# Altium schematic sheet MR26_GSS_8.SchDoc
size 383 x 296 mm; Origin: Eagle; OriginPath: C:\Users\David Nguyen\Downloads\eagle\eagle\MR26_GSS.sch; OriginSheet: 9; OriginDescription: 10 FPGA unused banks, GND & NC
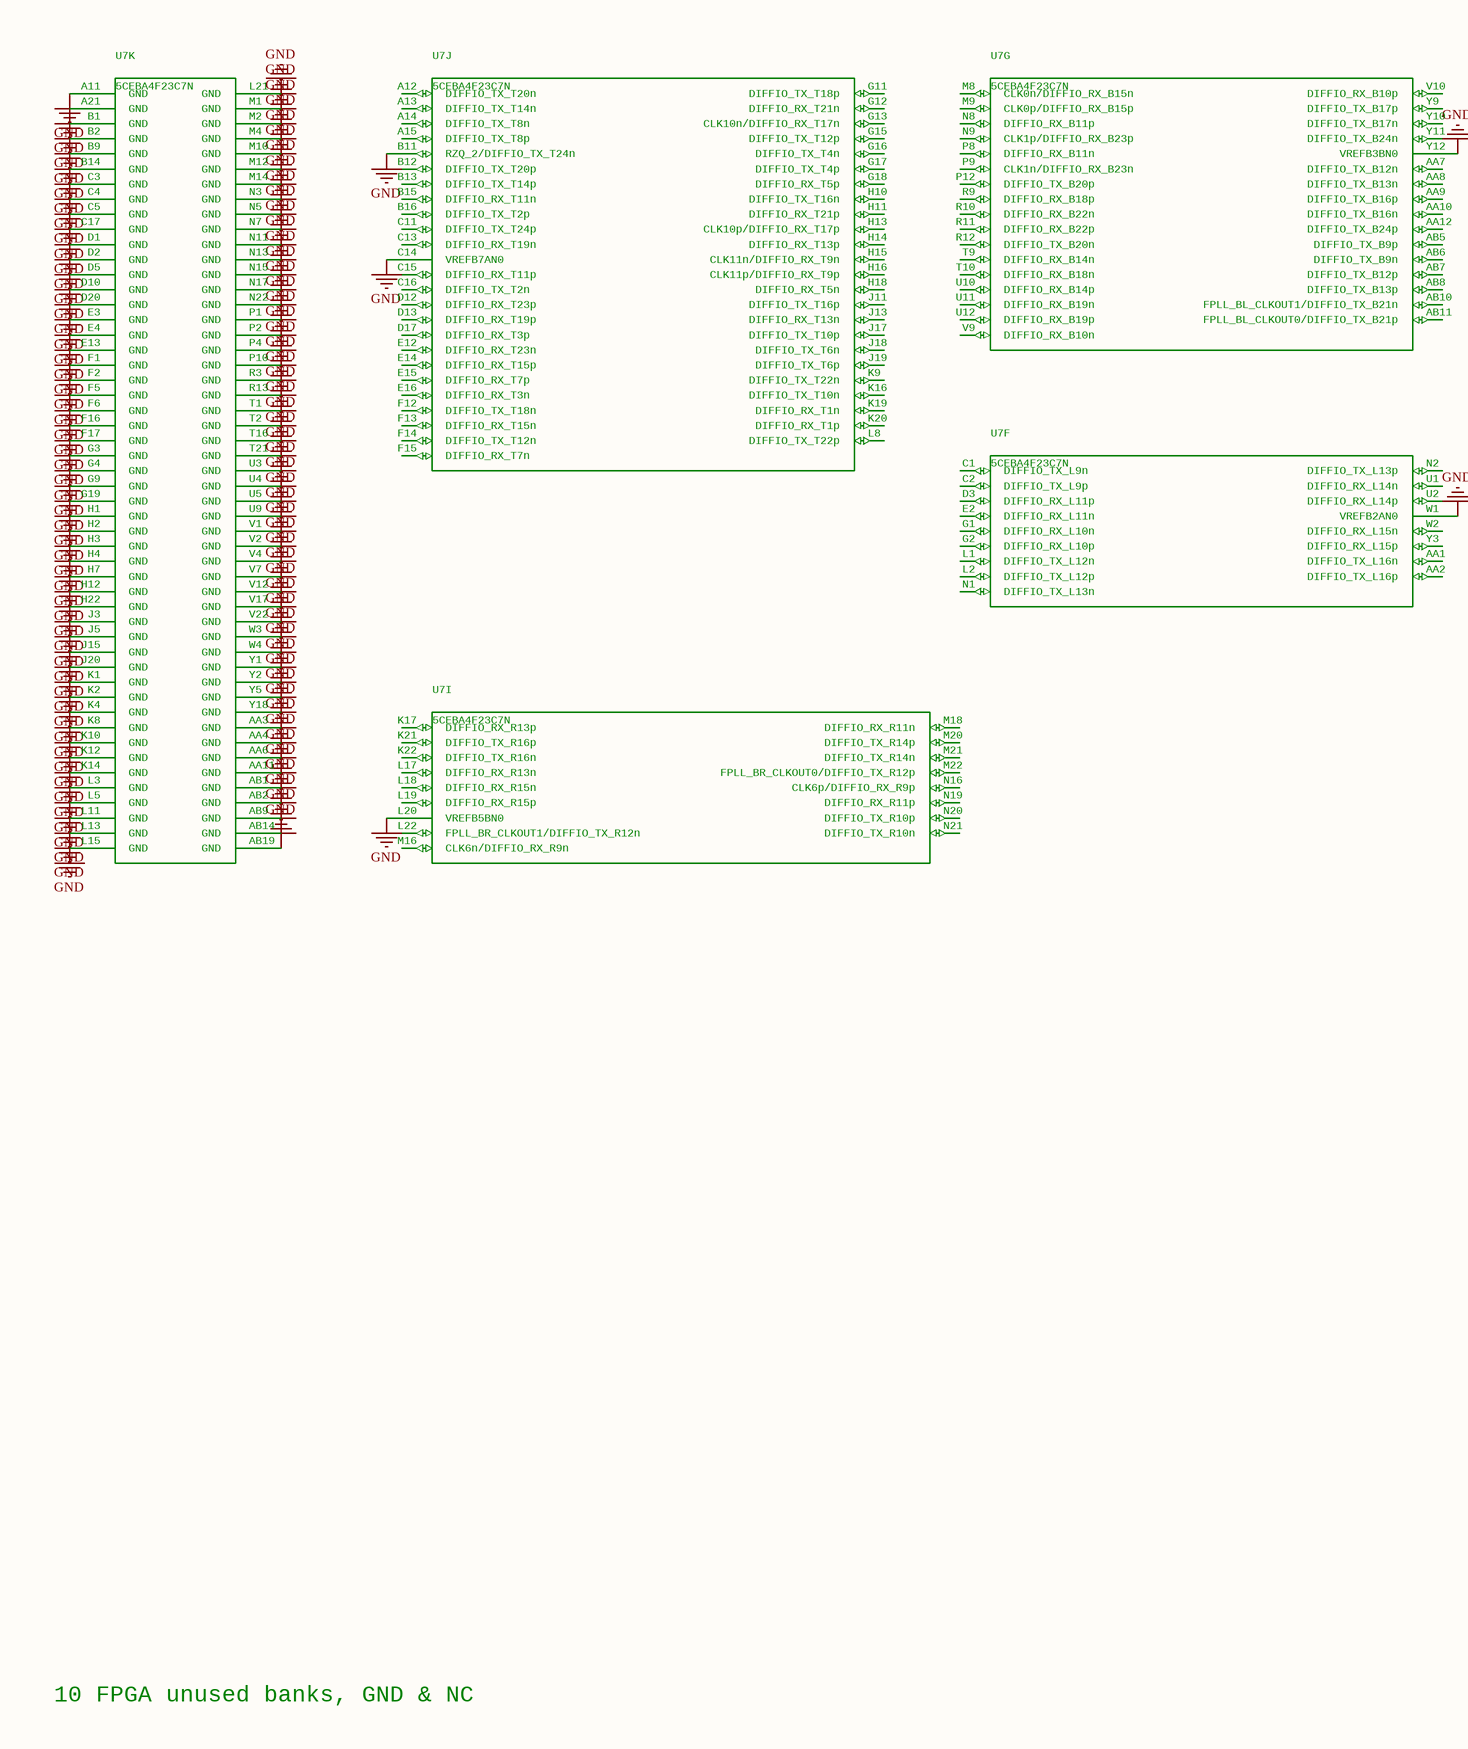
[diagram p0: MR26_GSS_8.SchDoc, left]
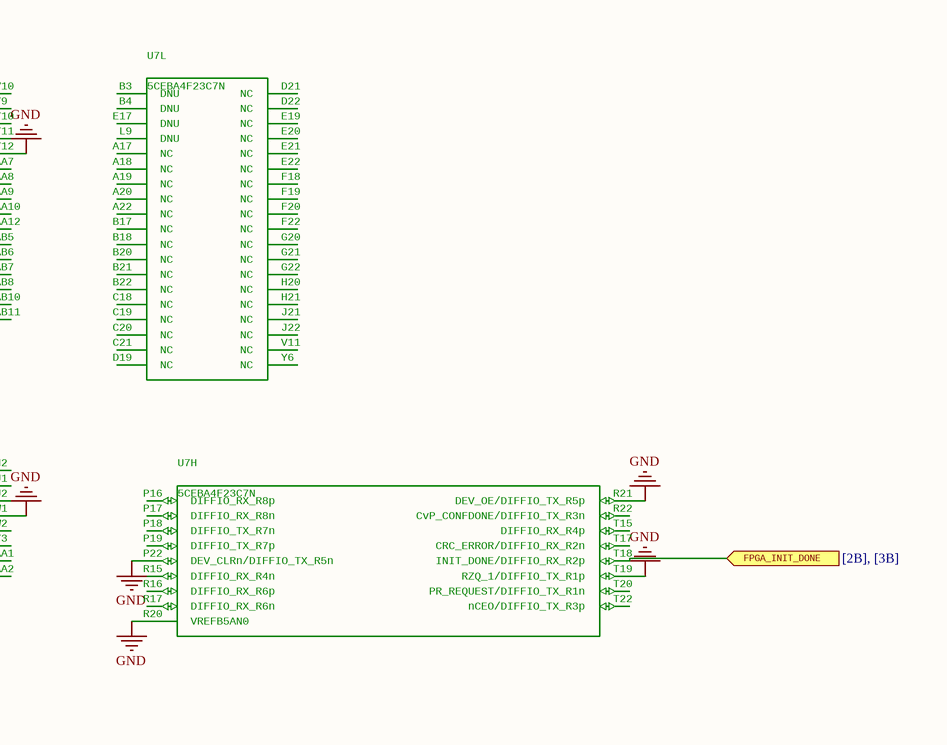
[diagram p1: MR26_GSS_8.SchDoc, right]

## Parts
U7  5CEBA4F23C7N  [FBGA-484_23x23_1.0mm]  (parts F,G,H,I,J,K,L of 12)

## Ports
FPGA_INIT_DONE (in, see [2B], [3B])

## Nets
GND: U7.A11(GND) U7.A21(GND) U7.AA3(GND) U7.AA4(GND) U7.AA6(GND) U7.AA11(GND) U7.AB1(GND) U7.AB2(GND) U7.AB9(GND) U7.AB14(GND) U7.AB19(GND) U7.B1(GND) U7.B2(GND) U7.B9(GND) U7.B11(RZQ_2/DIFFIO_TX_T24n) U7.B14(GND) U7.C3(GND) U7.C4(GND) U7.C5(GND) U7.C14(VREFB7AN0) U7.C17(GND) U7.D1(GND) U7.D2(GND) U7.D5(GND) U7.D10(GND) U7.D20(GND) U7.E3(GND) U7.E4(GND) U7.E13(GND) U7.F1(GND) U7.F2(GND) U7.F5(GND) U7.F6(GND) U7.F16(GND) U7.F17(GND) U7.G3(GND) U7.G4(GND) U7.G9(GND) U7.G19(GND) U7.H1(GND) U7.H2(GND) U7.H3(GND) U7.H4(GND) U7.H7(GND) U7.H12(GND) U7.H22(GND) U7.J3(GND) U7.J5(GND) U7.J15(GND) U7.J20(GND) U7.K1(GND) U7.K2(GND) U7.K4(GND) U7.K8(GND) U7.K10(GND) U7.K12(GND) U7.K14(GND) U7.L3(GND) U7.L5(GND) U7.L11(GND) U7.L13(GND) U7.L15(GND) U7.L20(VREFB5BN0) U7.L21(GND) U7.M1(GND) U7.M2(GND) U7.M4(GND) U7.M10(GND) U7.M12(GND) U7.M14(GND) U7.N3(GND) U7.N5(GND) U7.N7(GND) U7.N11(GND) U7.N13(GND) U7.N15(GND) U7.N17(GND) U7.N22(GND) U7.P1(GND) U7.P2(GND) U7.P4(GND) U7.P10(GND) U7.P22(DEV_CLRn/DIFFIO_TX_R5n) U7.R3(GND) U7.R13(GND) U7.R20(VREFB5AN0) U7.R21(DEV_OE/DIFFIO_TX_R5p) U7.T1(GND) U7.T2(GND) U7.T16(GND) U7.T19(RZQ_1/DIFFIO_TX_R1p) U7.T21(GND) U7.U3(GND) U7.U4(GND) U7.U5(GND) U7.U9(GND) U7.V1(GND) U7.V2(GND) U7.V4(GND) U7.V7(GND) U7.V12(GND) U7.V17(GND) U7.V22(GND) U7.W1(VREFB2AN0) U7.W3(GND) U7.W4(GND) U7.Y1(GND) U7.Y2(GND) U7.Y5(GND) U7.Y12(VREFB3BN0) U7.Y18(GND)
FPGA_INIT_DONE: U7.T18(INIT_DONE/DIFFIO_RX_R2p) ; port FPGA_INIT_DONE

Not connected (* = marked no-connect by the designer): U7 A12(DIFFIO_TX_T20n) A13(DIFFIO_TX_T14n) A14(DIFFIO_TX_T8n) A15(DIFFIO_TX_T8p) A17(NC) A18(NC) A19(NC) A20(NC) A22(NC) AA1(DIFFIO_TX_L16n) AA2(DIFFIO_TX_L16p) AA7(DIFFIO_TX_B12n) AA8(DIFFIO_TX_B13n) AA9(DIFFIO_TX_B16p) AA10(DIFFIO_TX_B16n) AA12(DIFFIO_TX_B24p) AB5(DIFFIO_TX_B9p) AB6(DIFFIO_TX_B9n) AB7(DIFFIO_TX_B12p) AB8(DIFFIO_TX_B13p) AB10(FPLL_BL_CLKOUT1/DIFFIO_TX_B21n) AB11(FPLL_BL_CLKOUT0/DIFFIO_TX_B21p) B3(DNU) B4(DNU) B12(DIFFIO_TX_T20p) B13(DIFFIO_TX_T14p) B15(DIFFIO_RX_T11n) B16(DIFFIO_TX_T2p) B17(NC) B18(NC) B20(NC) B21(NC) B22(NC) C1(DIFFIO_TX_L9n) C2(DIFFIO_TX_L9p) C11(DIFFIO_TX_T24p) C13(DIFFIO_RX_T19n) C15(DIFFIO_RX_T11p) C16(DIFFIO_TX_T2n) C18(NC) C19(NC) C20(NC) C21(NC) D3(DIFFIO_RX_L11p) D12(DIFFIO_RX_T23p) D13(DIFFIO_RX_T19p) D17(DIFFIO_RX_T3p) D19(NC) D21(NC) D22(NC) E2(DIFFIO_RX_L11n) E12(DIFFIO_RX_T23n) E14(DIFFIO_RX_T15p) E15(DIFFIO_RX_T7p) E16(DIFFIO_RX_T3n) E17(DNU) E19(NC) E20(NC) E21(NC) E22(NC) F12(DIFFIO_TX_T18n) F13(DIFFIO_RX_T15n) F14(DIFFIO_TX_T12n) F15(DIFFIO_RX_T7n) F18(NC) F19(NC) F20(NC) F22(NC) G1(DIFFIO_RX_L10n) G2(DIFFIO_RX_L10p) G11(DIFFIO_TX_T18p) G12(DIFFIO_RX_T21n) G13(CLK10n/DIFFIO_RX_T17n) G15(DIFFIO_TX_T12p) G16(DIFFIO_TX_T4n) G17(DIFFIO_TX_T4p) G18(DIFFIO_RX_T5p) G20(NC) G21(NC) G22(NC) H10(DIFFIO_TX_T16n) H11(DIFFIO_RX_T21p) H13(CLK10p/DIFFIO_RX_T17p) H14(DIFFIO_RX_T13p) H15(CLK11n/DIFFIO_RX_T9n) H16(CLK11p/DIFFIO_RX_T9p) H18(DIFFIO_RX_T5n) H20(NC) H21(NC) J11(DIFFIO_TX_T16p) J13(DIFFIO_RX_T13n) J17(DIFFIO_TX_T10p) J18(DIFFIO_TX_T6n) J19(DIFFIO_TX_T6p) J21(NC) J22(NC) K9(DIFFIO_TX_T22n) K16(DIFFIO_TX_T10n) K17(DIFFIO_RX_R13p) K19(DIFFIO_RX_T1n) K20(DIFFIO_RX_T1p) K21(DIFFIO_TX_R16p) K22(DIFFIO_TX_R16n) L1(DIFFIO_TX_L12n) L2(DIFFIO_TX_L12p) L8(DIFFIO_TX_T22p) L9(DNU) L17(DIFFIO_RX_R13n) L18(DIFFIO_RX_R15n) L19(DIFFIO_RX_R15p) L22(FPLL_BR_CLKOUT1/DIFFIO_TX_R12n) M8(CLK0n/DIFFIO_RX_B15n) M9(CLK0p/DIFFIO_RX_B15p) M16(CLK6n/DIFFIO_RX_R9n) M18(DIFFIO_RX_R11n) M20(DIFFIO_TX_R14p) M21(DIFFIO_TX_R14n) M22(FPLL_BR_CLKOUT0/DIFFIO_TX_R12p) N1(DIFFIO_TX_L13n) N2(DIFFIO_TX_L13p) N8(DIFFIO_RX_B11p) N9(CLK1p/DIFFIO_RX_B23p) N16(CLK6p/DIFFIO_RX_R9p) N19(DIFFIO_RX_R11p) N20(DIFFIO_TX_R10p) N21(DIFFIO_TX_R10n) P8(DIFFIO_RX_B11n) P9(CLK1n/DIFFIO_RX_B23n) P12(DIFFIO_TX_B20p) P16(DIFFIO_RX_R8p) P17(DIFFIO_RX_R8n) P18(DIFFIO_TX_R7n) P19(DIFFIO_TX_R7p) R9(DIFFIO_RX_B18p) R10(DIFFIO_RX_B22n) R11(DIFFIO_RX_B22p) R12(DIFFIO_TX_B20n) R15(DIFFIO_RX_R4n) R16(DIFFIO_RX_R6p) R17(DIFFIO_RX_R6n) R22(CvP_CONFDONE/DIFFIO_TX_R3n) T9(DIFFIO_RX_B14n) T10(DIFFIO_RX_B18n) T15(DIFFIO_RX_R4p) T17(CRC_ERROR/DIFFIO_RX_R2n) T20(PR_REQUEST/DIFFIO_TX_R1n) T22(nCEO/DIFFIO_TX_R3p) U1(DIFFIO_RX_L14n) U2(DIFFIO_RX_L14p) U10(DIFFIO_RX_B14p) U11(DIFFIO_RX_B19n) U12(DIFFIO_RX_B19p) V9(DIFFIO_RX_B10n) V10(DIFFIO_RX_B10p) V11(NC) W2(DIFFIO_RX_L15n) Y3(DIFFIO_RX_L15p) Y6(NC) Y9(DIFFIO_TX_B17p) Y10(DIFFIO_TX_B17n) Y11(DIFFIO_TX_B24n)

## Notes on the sheet
- 10 FPGA unused banks, GND & NC

## Library data of the parts
U7 = 5CEBA4F23C7NFBGA-484_23x23_1.0mm: GateName_1: A; SymbolName_1: 5CEBA4F23C7N_A; GateName_2: B; SymbolName_2: 5CEBA4F23C7N_B; GateName_3: C; SymbolName_3: 5CEBA4F23C7N_C; GateName_4: D; SymbolName_4: 5CEBA4F23C7N_D; GateName_5: E; SymbolName_5: 5CEBA4F23C7N_E; GateName_6: F; SymbolName_6: 5CEBA4F23C7N_F; GateName_7: G; SymbolName_7: 5CEBA4F23C7N_G; GateName_8: H; SymbolName_8: 5CEBA4F23C7N_H; GateName_9: I; SymbolName_9: 5CEBA4F23C7N_I; GateName_10: J; SymbolName_10: 5CEBA4F23C7N_J; GateName_11: K; SymbolName_11: 5CEBA4F23C7N_K; GateName_12: L; SymbolName_12: 5CEBA4F23C7N_L; DeviceName: FBGA-484_23x23_1.0mm; LibraryName: MR26; DeviceSetName: 5CEBA4F23C7N; MPN: 5CEBA4F23C7N